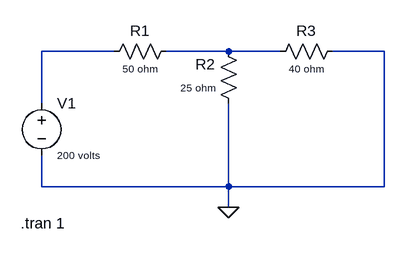
[diagram p0: schematic Draft2.asc]
Draft2.asc, the LTspice schematic file:
Version 4
SHEET 1 880 680
WIRE 48 128 -64 128
WIRE 224 128 128 128
WIRE 304 128 224 128
WIRE 464 128 384 128
WIRE -64 208 -64 128
WIRE -64 336 -64 288
WIRE 224 336 224 208
WIRE 224 336 -64 336
WIRE 464 336 464 128
WIRE 464 336 224 336
WIRE 224 368 224 336
FLAG 224 368 0
SYMBOL res 144 112 R90
WINDOW 0 0 56 VBottom 2
WINDOW 3 32 56 VTop 1
SYMATTR InstName R1
SYMATTR Value 50 ohm
SYMBOL res 240 224 R180
WINDOW 0 36 76 Left 2
WINDOW 3 36 40 Left 1
SYMATTR InstName R2
SYMATTR Value 25 ohm
SYMBOL res 288 144 R270
WINDOW 0 32 56 VTop 2
WINDOW 3 0 56 VBottom 1
SYMATTR InstName R3
SYMATTR Value 40 ohm
SYMBOL voltage -64 192 R0
WINDOW 3 24 96 Left 1
SYMATTR InstName V1
SYMATTR Value 200 volts
TEXT -96 392 Left 2 !.tran 1

The netlist it stands for:
* Draft2.asc
R1 N002 N001 50 ohm
R2 0 N002 25 ohm
R3 N002 0 40 ohm
V1 N001 0 200 volts
.tran 1
.backanno
.end